# Altium schematic sheet P09 DDR Control.SchDoc
size 420 x 297 mm
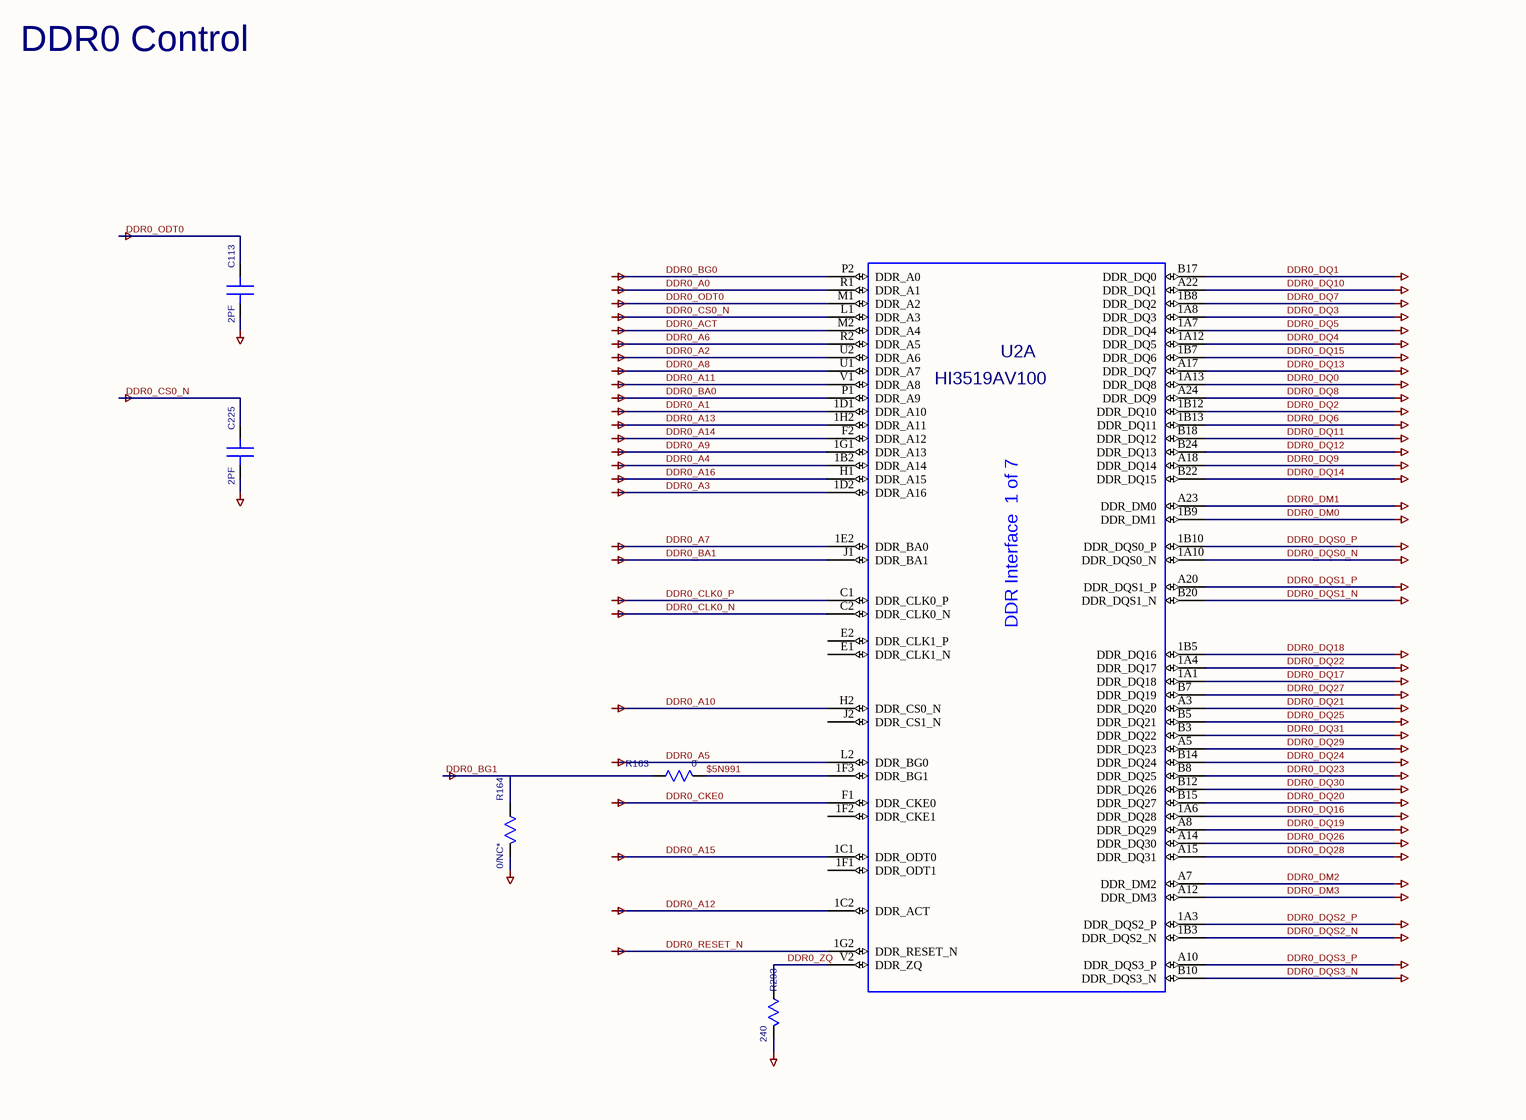
[diagram p0: P09 DDR Control.SchDoc]

## Parts
C113  2PF  [SC0402]
C225  2PF  [SC0402]
R163  0  [SR0402]
R164  0/NC*  [SR0402]
R293  240  [SR0402]
U2  DEVICE: HI3519AV100  [HBGA567-16-3737]  (hidden comment: HI3519A_VO)  (part A of 7)

## Nets
DDR0_A0: U2.R1(DDR_A1)
DDR0_A1: U2.1D1(DDR_A10)
DDR0_A2: U2.U2(DDR_A6)
DDR0_A3: U2.1D2(DDR_A16)
DDR0_A4: U2.1B2(DDR_A14)
DDR0_A5: U2.L2(DDR_BG0)
DDR0_A6: U2.R2(DDR_A5)
DDR0_A7: U2.1E2(DDR_BA0)
DDR0_A8: U2.U1(DDR_A7)
DDR0_A9: U2.1G1(DDR_A13)
DDR0_A10: U2.H2(DDR_CS0_N)
DDR0_A11: U2.V1(DDR_A8)
DDR0_A12: U2.1C2(DDR_ACT)
DDR0_A13: U2.1H2(DDR_A11)
DDR0_A14: U2.F2(DDR_A12)
DDR0_A15: U2.1C1(DDR_ODT0)
DDR0_A16: U2.H1(DDR_A15)
DDR0_ACT: U2.M2(DDR_A4)
DDR0_BA0: U2.P1(DDR_A9)
DDR0_BA1: U2.J1(DDR_BA1)
DDR0_BG0: U2.P2(DDR_A0)
DDR0_BG1: R163.1(A) R164.1(A)
DDR0_CKE0: U2.F1(DDR_CKE0)
DDR0_CLK0_N: U2.C2(DDR_CLK0_N)
DDR0_CLK0_P: U2.C1(DDR_CLK0_P)
DDR0_CS0_N: C225.1(A) U2.L1(DDR_A3)
DDR0_DM0: U2.1B9(DDR_DM1)
DDR0_DM1: U2.A23(DDR_DM0)
DDR0_DM2: U2.A7(DDR_DM2)
DDR0_DM3: U2.A12(DDR_DM3)
DDR0_DQ0: U2.1A13(DDR_DQ8)
DDR0_DQ1: U2.B17(DDR_DQ0)
DDR0_DQ2: U2.1B12(DDR_DQ10)
DDR0_DQ3: U2.1A8(DDR_DQ3)
DDR0_DQ4: U2.1A12(DDR_DQ5)
DDR0_DQ5: U2.1A7(DDR_DQ4)
DDR0_DQ6: U2.1B13(DDR_DQ11)
DDR0_DQ7: U2.1B8(DDR_DQ2)
DDR0_DQ8: U2.A24(DDR_DQ9)
DDR0_DQ9: U2.A18(DDR_DQ14)
DDR0_DQ10: U2.A22(DDR_DQ1)
DDR0_DQ11: U2.B18(DDR_DQ12)
DDR0_DQ12: U2.B24(DDR_DQ13)
DDR0_DQ13: U2.A17(DDR_DQ7)
DDR0_DQ14: U2.B22(DDR_DQ15)
DDR0_DQ15: U2.1B7(DDR_DQ6)
DDR0_DQ16: U2.1A6(DDR_DQ28)
DDR0_DQ17: U2.1A1(DDR_DQ18)
DDR0_DQ18: U2.1B5(DDR_DQ16)
DDR0_DQ19: U2.A8(DDR_DQ29)
DDR0_DQ20: U2.B15(DDR_DQ27)
DDR0_DQ21: U2.A3(DDR_DQ20)
DDR0_DQ22: U2.1A4(DDR_DQ17)
DDR0_DQ23: U2.B8(DDR_DQ25)
DDR0_DQ24: U2.B14(DDR_DQ24)
DDR0_DQ25: U2.B5(DDR_DQ21)
DDR0_DQ26: U2.A14(DDR_DQ30)
DDR0_DQ27: U2.B7(DDR_DQ19)
DDR0_DQ28: U2.A15(DDR_DQ31)
DDR0_DQ29: U2.A5(DDR_DQ23)
DDR0_DQ30: U2.B12(DDR_DQ26)
DDR0_DQ31: U2.B3(DDR_DQ22)
DDR0_DQS0_N: U2.1A10(DDR_DQS0_N)
DDR0_DQS0_P: U2.1B10(DDR_DQS0_P)
DDR0_DQS1_N: U2.B20(DDR_DQS1_N)
DDR0_DQS1_P: U2.A20(DDR_DQS1_P)
DDR0_DQS2_N: U2.1B3(DDR_DQS2_N)
DDR0_DQS2_P: U2.1A3(DDR_DQS2_P)
DDR0_DQS3_N: U2.B10(DDR_DQS3_N)
DDR0_DQS3_P: U2.A10(DDR_DQS3_P)
DDR0_ODT0: C113.1(A) U2.M1(DDR_A2)
DDR0_RESET_N: U2.1G2(DDR_RESET_N)
GND: C113.2(B) C225.2(B) R164.2(B) R293.2(B)
$5N991: R163.2(B) U2.1F3(DDR_BG1)
DDR0_ZQ: R293.1(A) U2.V2(DDR_ZQ)

Not connected (* = marked no-connect by the designer): U2 1F1(DDR_ODT1) 1F2(DDR_CKE1) E1(DDR_CLK1_N) E2(DDR_CLK1_P) J2(DDR_CS1_N)

## Notes on the sheet
- DDR0 Control
- (in symbol HI3519A_VO_5, part A) DDR Interface  1 of 7

## Library data of the parts
C113 = C: PARTS: 1; OriginalSymbolOrigin: (0,0); DEVICE: GRM1555C1H2R0CZ01D; LEVEL: STD; PINSWAP: (A,B); %208%%161%%192%%224%%195%%251%%179%%198%: SMD陶瓷电容; COMPONENT_HIGH_MAX: 0.55MM; %182%%238%%182%%168%%185%%164%%215%%247%%181%%231%%209%%185%(V): 50; %195%%232%%202%%246%: SMD陶瓷电容-50V-0.002nF-+/-0.25pF-NPO-0402-TS16949; CODE: 8070589; PKG_TYPE: SC0402
C225 = C: PARTS: 1; OriginalSymbolOrigin: (0,0); DEVICE: GRM1555C1H2R0CZ01D; LEVEL: STD; PINSWAP: (A,B); CODE: 8070589; %195%%232%%202%%246%: SMD陶瓷电容-50V-0.002nF-+/-0.25pF-NPO-0402-TS16949; %182%%238%%182%%168%%185%%164%%215%%247%%181%%231%%209%%185%(V): 50; COMPONENT_HIGH_MAX: 0.55MM; %208%%161%%192%%224%%195%%251%%179%%198%: SMD陶瓷电容; PKG_TYPE: SC0402
R163 = R_Dup1: PARTS: 1; OriginalSymbolOrigin: (0,0); PINSWAP: (A,B); DEVICE: RC0402JR_070R; LEVEL: STD; CODE: 7090800; %195%%232%%202%%246%: 片式厚膜电阻器-0.0625W-0ohm-< 50mohm-0402-1A-BT; %182%%238%%182%%168%%185%%166%%194%%202%(W): 0.06; %215%%232%%214%%181%%212%%202%%208%%237%%198%%171%%178%%238%: < 50mohm; COMPONENT_HIGH_MAX: 0.4MM; %208%%161%%192%%224%%195%%251%%179%%198%: 片式厚膜电阻器; VARIANT_ID: $5I974; PKG_TYPE: SR0402
R164 = R_Dup1: PARTS: 1; OriginalSymbolOrigin: (0,0); PINSWAP: (A,B); DEVICE: RC0402JR_070R; LEVEL: STD; %208%%161%%192%%224%%195%%251%%179%%198%: 片式厚膜电阻器; COMPONENT_HIGH_MAX: 0.4MM; %215%%232%%214%%181%%212%%202%%208%%237%%198%%171%%178%%238%: < 50mohm; %182%%238%%182%%168%%185%%166%%194%%202%(W): 0.06; %195%%232%%202%%246%: 片式厚膜电阻器-0.0625W-0ohm-< 50mohm-0402-1A-BT; CODE: 7090800; VARIANT_ID: $5I992; PKG_TYPE: SR0402
R293 = R_Dup1: PARTS: 1; OriginalSymbolOrigin: (0,0); PINSWAP: (A,B); DEVICE: RC0402FR_07240RL; LEVEL: STD; %182%%238%%182%%168%%185%%166%%194%%202%(W): 0.06; %215%%232%%214%%181%%212%%202%%208%%237%%198%%171%%178%%238%: +/- 1%; COMPONENT_HIGH_MAX: 0.4MM; CODE: 7091782; %195%%232%%202%%246%: 片式厚膜电阻器-0.0625W-240ohm-+/- 1%-0402; %208%%161%%192%%224%%195%%251%%179%%198%: 片式厚膜电阻器; PKG_TYPE: SR0402
U2 = HI3519A_VO_5: PARTS: 1; OriginalSymbolOrigin: (0,0); LEVEL: STD; HETERO: (HI3519A_DDR),(HI3519A_MIPI),(HI3519A_PER),(HI3519A_SYS),(HI3519A_VO),(HI3519A_PWR),(HI3519A_VSS); CaptureCellPackProp: HI3519A_VOA; PKG_TYPE: HBGA567-16-3737